# EAGLE schematic vga2 (EAGLE 6.5.0)
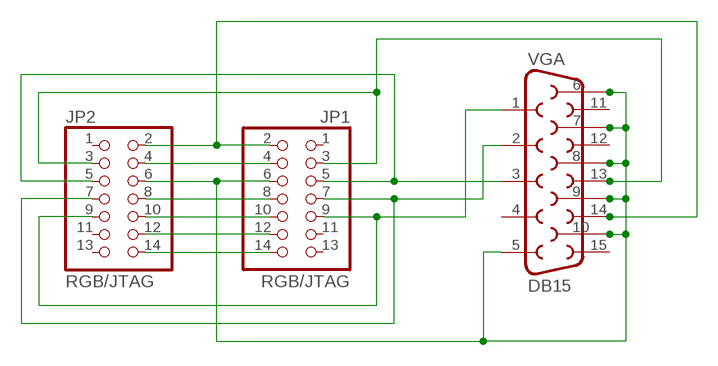
[diagram p0: schematic, sheet 1]

## Parts
JP1  RGB/JTAG  PINHD-2X7  [2X07]
JP2  RGB/JTAG  PINHD-2X7  [2X07]
VGA  DB15  [DB15]

## Nets
N$1: JP1.4 JP2.4
N$2: JP1.8 JP2.8
N$3: JP1.10 JP2.10
N$4: JP1.12 JP2.12
N$5: JP1.14 JP2.14
N$6: JP1.7 JP2.7 VGA.2
N$7: JP1.2 JP2.2 VGA.14
N$8: JP1.3 JP2.3 VGA.13
N$10: JP1.9 JP2.9 VGA.1
N$13: JP1.6 JP2.6 VGA.5 VGA.6 VGA.7 VGA.8 VGA.9 VGA.10
N$15: JP1.5 JP2.5 VGA.3
Unconnected: JP1.1 JP1.11 JP1.13 JP2.1 JP2.11 JP2.13 VGA.4 VGA.11 VGA.12 VGA.15

## Library data of the parts
JP1 JP2 = pinhead:PINHD-2X7: PIN HEADER
VGA = SparkFun-Connectors:DB15: DB15 / VGA right angle through-hole female connector.